# Altium schematic sheet Ampli.SchDoc
size A4
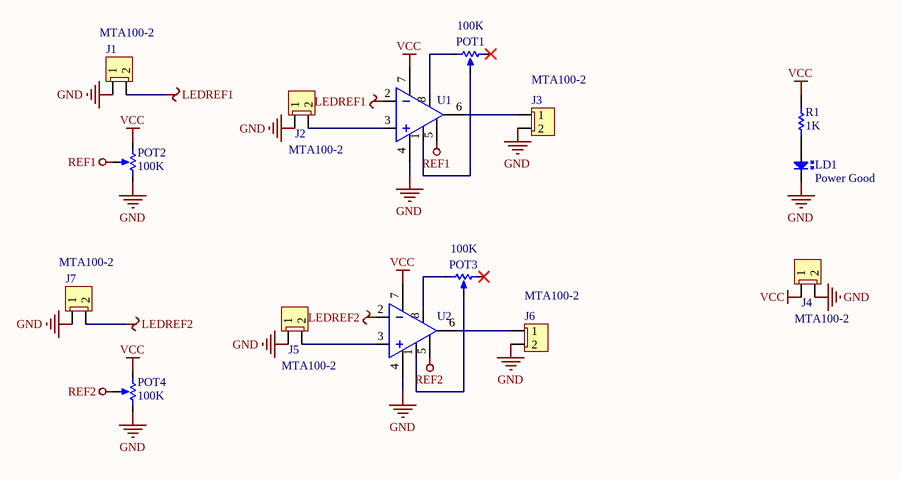
[diagram p0: Ampli.SchDoc]

## Parts
J1  Input  [MTA100-2]  (value not drawn)
J2  Input  [MTA100-2]  (value not drawn)
J3  Input  [MTA100-2]  (value not drawn)
J4  Input  [MTA100-2]  (value not drawn)
J5  Input  [MTA100-2]  (value not drawn)
J6  Input  [MTA100-2]  (value not drawn)
J7  Input  [MTA100-2]  (value not drawn)
LD1  Power Good  [LED 3mm Vertical]
POT1  value 100K  [VR1]  (hidden comment: ?????)
POT2  value 100K  [VR1]  (hidden comment: ?????)
POT3  value 100K  [VR1]  (hidden comment: ?????)
POT4  value 100K  [VR1]  (hidden comment: ?????)
R1  value 1K  [Axial 0.4" Step]  (hidden comment: Res 1/4W)
U1  OpAmp Single  [DIP8]  (value not drawn)
U2  OpAmp Single  [DIP8]  (value not drawn)

## Nets
GND: J1.1 J2.1 J3.2 J4.2 J5.1 J6.2 J7.1 LD1.2(K) POT2.3(Bot) POT4.3(Bot) U1.4(-Vcc) U2.4(-Vcc)
LEDREF1: J1.2 U1.2(-)
LEDREF2: J7.2 U2.2(-)
REF1: POT2.2(Tap) U1.5(B)
REF2: POT4.2(Tap) U2.5(B)
VCC: J4.1 POT2.1(Top) POT4.1(Top) R1.1 U1.7(+Vcc) U2.7(+Vcc)
NetJ2_2: J2.2 U1.3(+)
NetJ3_1: J3.1 U1.6(Out)
NetJ5_2: J5.2 U2.3(+)
NetJ6_1: J6.1 U2.6(Out)
NetLD1_1: LD1.1(A) R1.2
NetPOT1_1: POT1.1(Top) U1.8(NC)
NetPOT1_2: POT1.2(Tap) U1.1(B)
NetPOT3_1: POT3.1(Top) U2.8(NC)
NetPOT3_2: POT3.2(Tap) U2.1(B)

Not connected (* = marked no-connect by the designer): POT1 3(Bot)*; POT3 3(Bot)*

## Library data of the parts
J1-J7 = MTA100-2: MTA Male 0 Degres; Connector Type: MTA100-2
LD1 = LED 3mm Vertical: Through Hole; Published: 8-Jun-2000; LatestRevisionDate: 08-Jul-2005; LatestRevisionNote: Mech Layer 1 removed.; PackageReference: LED-1; Publisher: Altium Limited; PackageDescription: LED; 2 Leads; Comment_1: LED 3mm Vertical
POT1-POT4 = Res Pot 10T Vertical
R1 = Res 1/4W: Resistor; Published: 8-Jun-2000; LatestRevisionDate: 17-Jul-2002; LatestRevisionNote: Re-released for DXP Platform.; PackageReference: AXIAL-0.3; Publisher: Altium Limited; PackageDescription: Axial Device, Thru-Hole; 2 Leads; 0.3 in Pin Spacing